# Altium schematic sheet Minimum_system.SchDoc
size 431 x 279 mm; ENG_APP_DATE: --/--/--; DSN_APP_DATE: --/--/--; CHK_APP_DATE: --/--/--
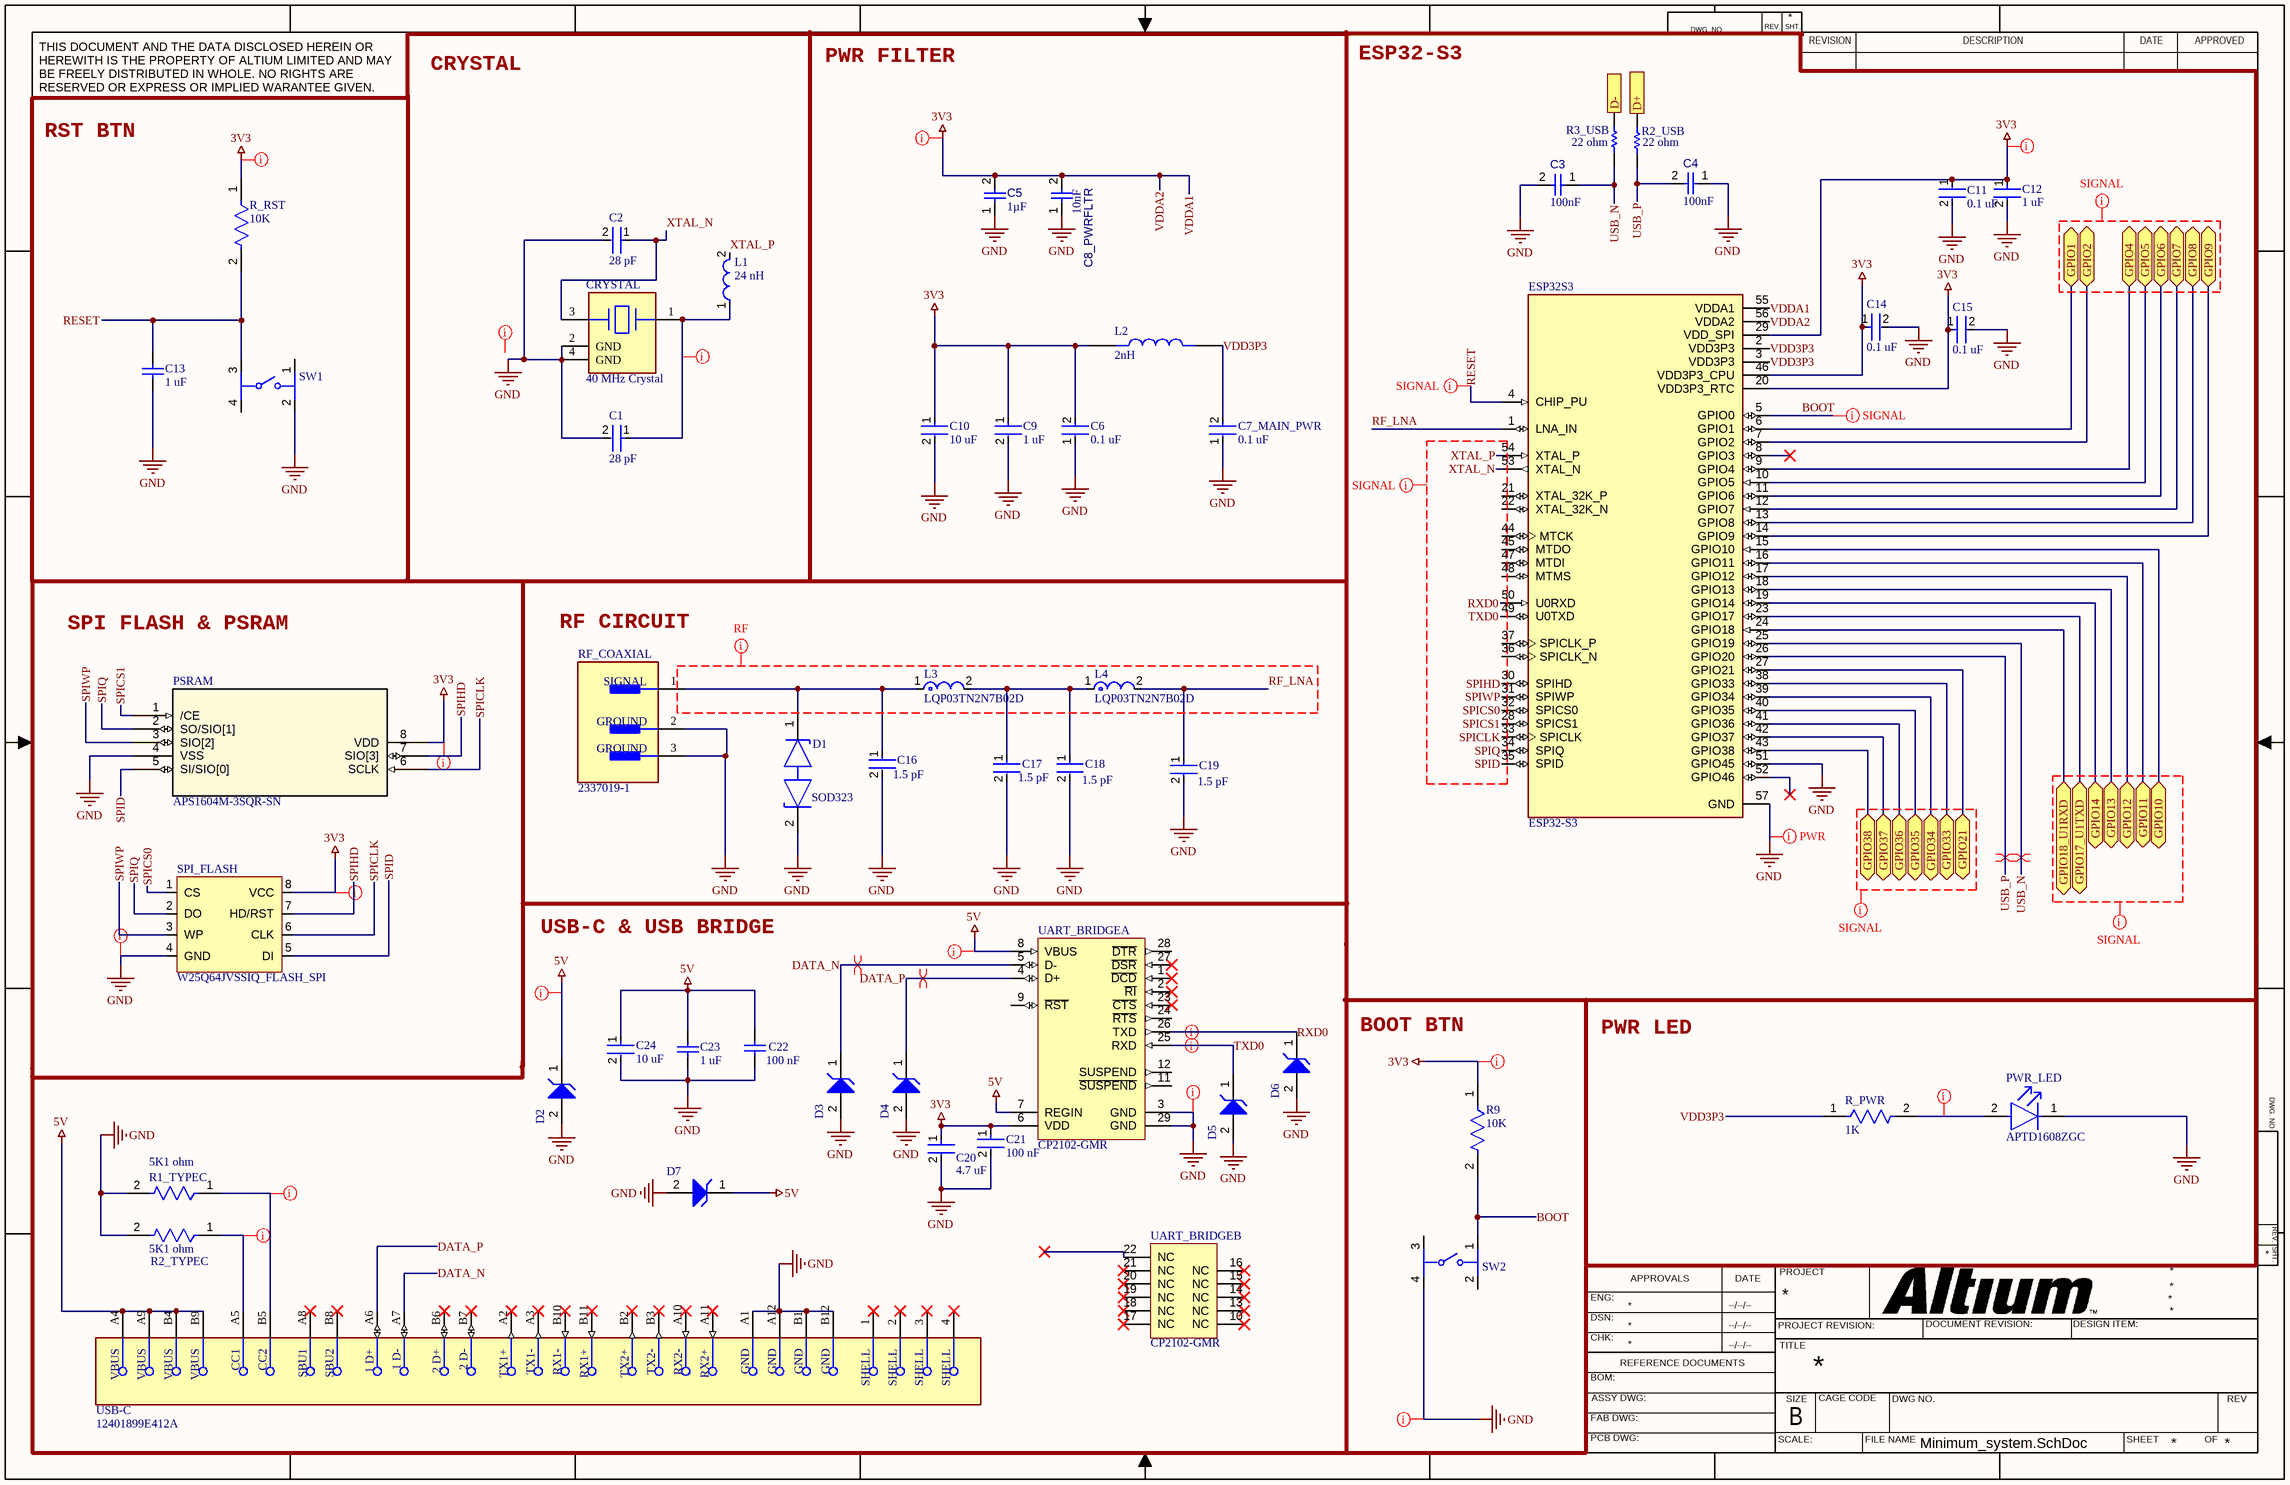
[diagram p0: Minimum_system.SchDoc]

## Parts
C1  28 pF  [FP-GQM219-0_15-MFG]
C2  28 pF  [FP-GQM219-0_15-MFG]
C3  value 100nF  [CAPC0402(1005)60_L]  (hidden comment: Capacitor 100nF +/-20% 50V 0402)
C4  value 100nF  [CAPC0402(1005)60_L]  (hidden comment: Capacitor 100nF +/-20% 50V 0402)
C5  value 1µF  [CAPC1608X90X35ML15T15]  (hidden comment: Capacitor 1uF +/- 10% 16V 0603)
C6  0.1 uF  [FP-C1608-080-0_1-IPC_B]
C7_MAIN_PWR  0.1 uF  [FP-C1608-080-0_1-IPC_B]
C8_PWRFLTR  value 10nF  [CAPC0402(1005)60_L]  (hidden comment: Capacitor 10nF +/-20% 50V 0402)
C9  1 uF  [FP-GRM21B-0_2-e0_2_0_7-MFG]
C10  10 uF  [FP-GRM188-0_15-IPC_C]
C11  0.1 uF  [FP-C1608-080-0_1-IPC_B]
C12  1 uF  [FP-GRM21B-0_2-e0_2_0_7-MFG]
C13  1 uF  [CAPC2013X140X50NL20T25]
C14  0.1 uF  [FP-CC0201-BA-MFG]
C15  0.1 uF  [FP-CC0201-BA-MFG]
C16  1.5 pF  [FP-GRM033-0_03-MFG]
C17  1.5 pF  [FP-GRM033-0_03-MFG]
C18  1.5 pF  [FP-GRM033-0_03-MFG]
C19  1.5 pF  [FP-GRM033-0_03-MFG]
C20  4.7 uF  [FP-GCJ31C-0_3-IPC_C]
C21  100 nF  [FP-GRM155-0_05-MFG]
C22  100 nF  [CAPC0603X33X15NL03T05]
C23  1 uF  [CAPC2013X140X50NL20T25]
C24  10 uF  [FP-GRM188-0_15-IPC_C]
CRYSTAL  40 MHz Crystal  [FP-ABM8AIG-MFG]
D1  SOD323  [FP-SOD323-CA-MFG]
D2  824520581  [WE-TVSP_DO-214AA_Unidirectional]  (value not drawn)
D3  824520581  [WE-TVSP_DO-214AA_Unidirectional]  (value not drawn)
D4  824520581  [WE-TVSP_DO-214AA_Unidirectional]  (value not drawn)
D5  824520581  [WE-TVSP_DO-214AA_Unidirectional]  (value not drawn)
D6  824520581  [WE-TVSP_DO-214AA_Unidirectional]  (value not drawn)
D7  824520581  [WE-TVSP_DO-214AA_Unidirectional]  (value not drawn)
ESP32S3  ESP32-S3  [IC_ESP32-S3]
L1  24 nH  [FP-LQW15AN_00-W0_5-0_1-MFG]
L2  value 2nH  [INDC0603X28N]  (hidden comment: ATFC-0201HQ-2N0B-T)
L3  LQP03TN2N7B02D  [FP-LQP03TG_02-IPC_A]
L4  LQP03TN2N7B02D  [FP-LQP03TG_02-IPC_A]
PSRAM  APS1604M-3SQR-SN  [SOP8L_APS1604M-3SQR-SN_APY]
PWR_LED  APTD1608ZGC  [FP-APTD1608ZGC-MFG]
R1_TYPEC  5K1 ohm  [FP-CRCW1206-e3-IPC_B]
R2_TYPEC  5K1 ohm  [FP-CRCW1206-e3-IPC_B]
R2_USB  22 ohm  [RESC1608X55X25LL10T15]
R3_USB  22 ohm  [RESC1608X55X25LL10T15]
R9  10K  [FP-AC0603-IPC_A]
R_PWR  1K  [FP-RP732B-MFG]
R_RST  10K  [FP-AC0603-IPC_A]
RF_COAXIAL  2337019-1  [FP-2337019-1-MFG]
SPI_FLASH  W25Q64JVSSIQ_FLASH_SPI  [SOIC127P790X216-8N]
SW1  PTS810SJM250SMTRLFS  [FP-PTS810SJM250SMTRLFS-MFG]  (value not drawn)
SW2  PTS810SJM250SMTRLFS  [FP-PTS810SJM250SMTRLFS-MFG]  (value not drawn)
UART_BRIDGE  CP2102-GMR  [SLAB-QFN-28-3125x3125TP_M]  (parts A,B of 2)
USB-C  12401899E412A  [FP-12401899E412A-MFG]

## Ports
D+, D-, GPIO1 (bidir), GPIO2 (bidir), GPIO4 (bidir), GPIO5 (bidir), GPIO6 (bidir), GPIO7 (bidir), GPIO8 (bidir), GPIO9 (bidir), GPIO10 (bidir), GPIO11 (bidir), GPIO12 (bidir), GPIO13 (bidir), GPIO14 (bidir), GPIO17_U1TXD (bidir), GPIO18_U1RXD (bidir), GPIO21 (bidir), GPIO33 (bidir), GPIO34 (bidir), GPIO35 (bidir), GPIO36 (bidir), GPIO37 (bidir), GPIO38 (bidir)

## Nets
5V: C22.2 C23.1 C24.1 D2.1(K) D7.1(K) UART_BRIDGE.7(REGIN) UART_BRIDGE.8(VBUS) USB-C.A4(VBUS) USB-C.A9(VBUS) USB-C.B4(VBUS) USB-C.B9(VBUS)
GND: C1.2 C2.2 C3.2 C4.1 C5.1 C6.1 C7_MAIN_PWR.1 C8_PWRFLTR.1 C9.2 C10.2 C11.2 C12.2 C13.2 C14.2 C15.2 C16.2 C17.2 C18.2 C19.2 C20.2 C21.2 C22.1 C23.2 C24.2 CRYSTAL.2(GND) CRYSTAL.4(GND) D1.2(K2) D2.2(A) D3.2(A) D4.2(A) D5.2(A) D6.2(A) D7.2(A) ESP32S3.51(GPIO45) ESP32S3.57(GND) PSRAM.4(VSS) PWR_LED.1(C) R1_TYPEC.2 R2_TYPEC.2 RF_COAXIAL.2(GROUND) RF_COAXIAL.3(GROUND) SPI_FLASH.4(GND) SW1.2 SW2.4 UART_BRIDGE.3(GND) UART_BRIDGE.29(GND) USB-C.A1(GND) USB-C.A12(GND) USB-C.B1(GND) USB-C.B12(GND)
VDDA1: C5.2 C6.2 C8_PWRFLTR.2 C9.1 C10.1 C11.1 C12.1 C14.1 C15.1 C20.1 C21.1 ESP32S3.20(VDD3P3_RTC) ESP32S3.29(VDD_SPI) ESP32S3.46(VDD3P3_CPU) ESP32S3.55(VDDA1) ESP32S3.56(VDDA2) L2.1 PSRAM.8(VDD) R9.1 R_RST.1 SPI_FLASH.8(VCC) UART_BRIDGE.6(VDD)  [also labelled 3V3, VDDA2]
BOOT: ESP32S3.5(GPIO0) R9.2 SW2.1
D+: R2_USB.1 ; port D+
D-: R3_USB.1 ; port D-
DATA_N: D3.1(K) UART_BRIDGE.5(D-) USB-C.A7(1_D-)
DATA_P: D4.1(K) UART_BRIDGE.4(D+) USB-C.A6(1_D+)
GPIO1: ESP32S3.6(GPIO1) ; port GPIO1
GPIO2: ESP32S3.7(GPIO2) ; port GPIO2
GPIO4: ESP32S3.9(GPIO4) ; port GPIO4
GPIO5: ESP32S3.10(GPIO5) ; port GPIO5
GPIO6: ESP32S3.11(GPIO6) ; port GPIO6
GPIO7: ESP32S3.12(GPIO7) ; port GPIO7
GPIO8: ESP32S3.13(GPIO8) ; port GPIO8
GPIO9: ESP32S3.14(GPIO9) ; port GPIO9
GPIO10: ESP32S3.15(GPIO10) ; port GPIO10
GPIO11: ESP32S3.16(GPIO11) ; port GPIO11
GPIO12: ESP32S3.17(GPIO12) ; port GPIO12
GPIO13: ESP32S3.18(GPIO13) ; port GPIO13
GPIO14: ESP32S3.19(GPIO14) ; port GPIO14
GPIO17_U1TXD: ESP32S3.23(GPIO17) ; port GPIO17_U1TXD
GPIO18_U1RXD: ESP32S3.24(GPIO18) ; port GPIO18_U1RXD
GPIO21: ESP32S3.27(GPIO21) ; port GPIO21
GPIO33: ESP32S3.38(GPIO33) ; port GPIO33
GPIO34: ESP32S3.39(GPIO34) ; port GPIO34
GPIO35: ESP32S3.40(GPIO35) ; port GPIO35
GPIO36: ESP32S3.41(GPIO36) ; port GPIO36
GPIO37: ESP32S3.42(GPIO37) ; port GPIO37
GPIO38: ESP32S3.43(GPIO38) ; port GPIO38
RESET: C13.1 ESP32S3.4(CHIP_PU) R_RST.2 SW1.3
RF_LNA: C19.1 ESP32S3.1(LNA_IN) L4.2
RXD0: D6.1(K) ESP32S3.50(U0RXD) UART_BRIDGE.26(TXD)
SPICLK: ESP32S3.33(SPICLK) PSRAM.6(SCLK) SPI_FLASH.6(CLK)
SPICS0: ESP32S3.32(SPICS0) SPI_FLASH.1(CS)
SPICS1: ESP32S3.28(SPICS1) PSRAM.1(/CE)
SPID: ESP32S3.35(SPID) PSRAM.5(SI/SIO[0]) SPI_FLASH.5(DI)
SPIHD: ESP32S3.30(SPIHD) PSRAM.7(SIO[3]) SPI_FLASH.7(HD/RST)
SPIQ: ESP32S3.34(SPIQ) PSRAM.2(SO/SIO[1]) SPI_FLASH.2(DO)
SPIWP: ESP32S3.31(SPIWP) PSRAM.3(SIO[2]) SPI_FLASH.3(WP)
TXD0: D5.1(K) ESP32S3.49(U0TXD) UART_BRIDGE.25(RXD)
USB_N: C3.1 ESP32S3.25(GPIO19) R3_USB.2
USB_P: C4.2 ESP32S3.26(GPIO20) R2_USB.2
VDD3P3: C7_MAIN_PWR.2 ESP32S3.2(VDD3P3) ESP32S3.3(VDD3P3) L2.2 R_PWR.1
XTAL_N: C2.1 CRYSTAL.3 ESP32S3.53(XTAL_N)
XTAL_P: ESP32S3.54(XTAL_P) L1.2
NetC1_1: C1.1 CRYSTAL.1 L1.1
NetC16_1: C16.1 D1.1(K1) L3.1 RF_COAXIAL.1(SIGNAL)
NetC17_1: C17.1 C18.1 L3.2 L4.1
NetPWR_LED_2: PWR_LED.2(A) R_PWR.2
NetR1_TYPEC_1: R1_TYPEC.1 USB-C.B5(CC2)
NetR2_TYPEC_1: R2_TYPEC.1 USB-C.A5(CC1)

Not connected (* = marked no-connect by the designer): ESP32S3 8(GPIO3)* 21(XTAL_32K_P) 22(XTAL_32K_N) 36(SPICLK_N) 37(SPICLK_P) 44(MTCK) 45(MTDO) 47(MTDI) 48(MTMS) 52(GPIO46)*; SW1 1 4; SW2 2 3; UART_BRIDGE 1(~{DCD})* 2(~{RI})* 9(~{RST}) 10(NC)* 11(~{SUSPEND}) 12(SUSPEND) 13(NC)* 14(NC)* 15(NC)* 16(NC)* 17(NC)* 18(NC)* 19(NC)* 20(NC)* 21(NC)* 22(NC)* 23(~{CTS})* 24(~{RTS}) 27(~{DSR})* 28(~{DTR}); USB-C 1(SHELL)* 2(SHELL)* 3(SHELL)* 4(SHELL)* A2(TX1+)* A3(TX1-)* A8(SBU1)* A10(RX2-)* A11(RX2+)* B2(TX2+)* B3(TX2-)* B6(2_D+)* B7(2_D-)* B8(SBU2)* B10(RX1-)* B11(RX1+)*

## Layout directives
differential pair: DATA_N, DATA_P, USB_N, USB_P
net class SIGNAL: (no net found under the mark), BOOT, RXD0, SPICLK, SPICS0, SPICS1, SPID, SPIHD, SPIQ, SPIWP, TXD0, XTAL_N, XTAL_P
net class POWER: 5V, (no net found under the mark), GND, NetC1_1, NetPWR_LED_2, NetR1_TYPEC_1, NetR2_TYPEC_1, VDDA1
mark named SIGNAL: RESET
net class RF: RF_LNA

## Notes on the sheet
- CRYSTAL
- PWR FILTER
- ESP32-S3
- RST BTN
- SPI FLASH & PSRAM
- RF CIRCUIT
- USB-C & USB BRIDGE
- BOOT BTN
- PWR LED
- Labels drawn without touching a wire or pin: \
- DWG. NO.
- REV.
- SHT.
- THIS DOCUMENT AND THE DATA DISCLOSED HEREIN OR HEREWITH IS THE PROPERTY OF ALTIUM LIMITED AND MAY BE FREELY DISTRIBUTED IN WHOLE. NO RIGHTS ARE RESERVED OR EXPRESS OR IMPLIED WARANTEE GIVEN.
- REVISION
- DESCRIPTION
- DATE
- APPROVED
- ENG:
- APPROVALS
- PROJECT
- DSN:
- CHK:
- REFERENCE DOCUMENTS
- PROJECT REVISION:
- TITLE
- DOCUMENT REVISION:
- DESIGN ITEM:
- BOM:
- FAB DWG:
- PCB DWG:
- ASSY DWG:
- SCALE:
- SIZE
- B
- CAGE CODE
- FILE NAME
- DWG NO.
- SHEET
- OF
- REV

## Library data of the parts
C1 C2 = CMP-06035-024923-1: Ceramic Capacitor 28pF ±2% 250VDC C0G 0805 Paper T/R
C3 C4 = CMP-001-00067-3: Chip Capacitor, 100nF +/-20%, 50V, 0402, Thickness 0.6 mm; Tolerance: 10%; Min Operating Temperature: -55°C; Pins: 2; Case/Package: 0402; Max Operating Temperature: 85°C; Voltage Rating: 50V; Mounting Technology: SMT
C5 = CMP-001-00004-6: Chip Capacitor, 1 uF, +/- 10%, 16 V, 0603 (1608 Metric); Capacitor Type: Ceramic; Mounting Technology: SM; RoHS Compliant: True; Min Operating Temperature: -55°C; Case/Package: 0603; Pins: 2; Voltage Rating: 16V; Max Operating Temperature: 125°C; Tolerance: 10%
C6 C7_MAIN_PWR C11 = CMP-2000-04982-2: Multilayer Ceramic Capacitors 100nF ±10% 50V X7R SMD 0603; REACH SVHC: No SVHC; Voltage: 50V; Min Operating Temperature: -55°C; Package Quantity: 1; Case Code (Metric): 1608; Series: C; Termination: SMD/SMT; Length: 1.6mm; Voltage Rating: 50V; Case Code (Imperial): 0603; Number of Pins: 2; RoHS Compliant: Yes; Thickness: 0.037inch; Resistor Type: Ceramic; Radiation Hardening: No; Weight: 7.1E-05oz; Mount: Surface Mount; Capacitance: 100nF; Voltage Rating (DC): 50V; Construction: Flat; Tolerance: 10%; Lead Free: Lead Free; Case/Package: 0603; Max Operating Temperature: 125°C; Height: 0.8mm; Depth: 0.8mm; Packaging: Tape and Reel; Width: 0.031inch; Dielectric Material: Ceramic; Dielectric: X7R
C8_PWRFLTR = CMP-001-00069-3: Chip Capacitor, 10nF +/-20%, 50V, 0402, Thickness 0.6 mm; Tolerance: 5%; Max Operating Temperature: 85°C; Pins: 2; Case/Package: 0402; Voltage Rating: 50V; Min Operating Temperature: -55°C; Mounting Technology: SMT
C9 C12 = CMP-06035-022504-1: Chip Multilayer Ceramic Capacitors for General Purpose, 0805, 1.0uF, X7S, 22%, 10%, 100V; Capacitance: 1uF; Width: 1.25mm; Dielectric: X7S; Length: 2mm; Thickness: 1.25mm; Voltage Rating (DC): 100V; Tolerance: 10%
C10 C24 = CMP-06035-033844-1: Chip Multilayer Ceramic Capacitors for General Purpose, 0603, 10uF, X5R, 15%, 20%, 10V; Dielectric: X5R; Thickness: 800um; Tolerance: 20%; Length: 1.6mm; Voltage Rating (DC): 10V; Width: 800um; Capacitance: 10uF
C13 C23 = CMP-2007-04663-1: Part Number: 0805YD105MAT2A; Manufacturer: AVX Interconnect / Elco
C14 C15 = CMP-03422-000955-1: CC0201 100 nF X5R 20.00% 10 V; Manufacturer: Yageo; Manufacturer Part Number: CC0201MRX5R6BB104; Tolerance: 0.2; Temperature Coefficient: 15%; Capacitance: 100 nF; Voltage Rating: 10 V; Value: 100 nF; Material: Ceramic; Height: 0.33mm; ComponentLink2Description: Datasheet; Device Class L3: Ceramic Capacitors; Lead Free: Yes; Temperature Range Low: -55°C; Temperature Range High: +85°C; Mouser Description: Cap Ceramic 0.1uF 10V X5R 20% SMD 0201 85°C Paper T/R; Automotive: No; Temperature Characteristic: X5R; RoHS: TRUE; Octopart: https://octopart.com/cc0201mrx5r6bb104-yageo-82228190; Ipc Land Pattern Name: CAPC6030X30; ComponentLink2URL: http://www.yageo.com/documents/recent/UPY-GPHC_X5R_4V-to-50V_25.pdf; Temperature: -55°C to +85°C; Category: Cap; Package: CC0201-BA; Device Class L2: Capacitors; Footprint Url: http://www.yageo.com/exep/pages/download/literatures/UPY-C_GEN_24.pdf; Device Class L1: Passive Components
C16-C19 = CMP-2010-01517-2: Chip Multilayer Ceramic Capacitors for General Purpose, 0201, 1.5pF, C0G, 30ppm/°C, 0.1pF, 50V; Case Code (Imperial): 0201; Width: 0.012inch; Case Code (Metric): 0603; Length: 0.024inch; Termination: SMD/SMT; Mount: Surface Mount; Min Operating Temperature: -55°C; Case/Package: 0201; Package Quantity: 15000; Thickness: 0.013inch; Packaging: Tape and Reel; Capacitance: 1.5pF; Max Operating Temperature: 125°C; Voltage Rating: 50V; Voltage Rating (DC): 50V
C20 = CMP-06035-027821-1: Cap Ceramic 4.7uF 16V X7R 10% Pad SMD 1206 Soft Termination  +125°C Automotive T/R
C21 = CMP-06035-062118-1: Chip Multilayer Ceramic Capacitors for General Purpose, 0402, 0.10uF, X7R, 15%, 20%, 50V; RoHS Compliant: Yes
C22 = CMP-1033-00660-2: Part Number: 02016D104KAT4A; Manufacturer: AVX Interconnect / Elco
CRYSTAL = CMP-27762-015630-1: Crystal 40MHz ±20ppm (Tol) ±100ppm (Stability) 12pF FUND 35Ω Automotive 4-Pin Ultra Mini-CSMD T/R; ESR (Equivalent Series Resistance): 35R; Packaging: Tape and Reel; Height: 0.031inch; Min Operating Temperature: -40°C; Length: 0.126inch; Width: 0.098inch; Frequency: 40MHz; Series: ABM8AIG; Ratings: AEC-Q200; RoHS Compliant: Yes; Frequency Stability: 100ppm; Max Operating Temperature: 125°C; Case/Package: SMD/SMT; Load Capacitance: 12pF; Frequency Tolerance: 20ppm; Mount: Surface Mount
D1 = CMP-14432-000001-1: TVS DIODE 5V 14V SOD323
D2-D7 = CMP-03913-71101600-2: TVS diode [Würth Elektronik] 824520581 TVS diode; Power Line Protection: No; Max Breakdown Voltage: 67.8V; Peak Pulse Power: 600W; Peak Pulse Current: 6.5A; Leakage Current: 1µA; Number of Unidirectional Channels: 1; Clamping Voltage: 93.6V; Polarity: Unidirectional; Reverse Standoff Voltage: 58V; Packaging: Cut Tape; Composition: Zener; Mount: Surface Mount; REACH SVHC: Unknown; RoHS: Compliant; Height: 2.4mm; Length: 4.32mm; Max Operating Temperature: 150°C; Min Operating Temperature: -65°C; Number of Pins: 2; Width: 3.62mm; Min Breakdown Voltage: 67.8V
ESP32S3 = CMP-031-00006-2: IC RF TxRx + MCU Bluetooth, WiFi 802.11b/g/n, Bluetooth v5.0 2.412GHz ~ 2.484GHz 56-VFQFN Exposed Pad; MF: Espressif Systems; Purchase-URL: https://pricing.snapeda.com/search/part/ESP32-S3/?ref=eda; Value: *; SnapEDA_Link: https://www.snapeda.com/parts/ESP32-S3/Espressif+Systems/view-part/?ref=snap; Component Type: Standard; Case/Package: None; Design Item ID: ESP32-S3; Availability: In Stock; Pins: 57; MP: ESP32-S3; Source: ESP32-S3.SchLib; Check_prices: https://www.snapeda.com/parts/ESP32-S3/Espressif+Systems/view-part/?ref=eda; Price: None
L1 = CMP-06042-007532-1: Wire Wound RF Inductor 24nH ±2% 280mA 0.52Ω 0402 (1005); Q Factor: 25; Core Material: Air; Test Frequency: 100MHz; Current: 270mA; Self Resonant Frequency: 3.5GHz; Shielding: Unshielded; DC Resistance (DCR): 520mR; Height: 0.5mm; Lead Free: Lead Free; Max DC Current: 280mA; Width: 0.02inch; Number of Pins: 2; Inductance Tolerance: 2%; Military Standard: Not; REACH SVHC: No SVHC; Case Code (Imperial): 0402; Inductance: 24nH; Case/Package: 0402; Current Rating: 280mA; Min Operating Temperature: -55°C; Case Code (Metric): 1005; Length: 1mm; Mount: Surface Mount; DC Current: 280mA; Weight: 2.8E-05oz; Package Quantity: 10000; Termination: SMD/SMT; Packaging: Tape and Reel; Max Operating Temperature: 125°C; Depth: 0.6mm; Tolerance: 2%
L2 = CMP-006-00023-1: MF: {'manufacturer': u'Abracon LLC'}; MP: ATFC-0201HQ-2N0B-T; Design Item ID: ATFC-0201HQ-2N0B-T; Availability: Unavailable; Component Type: Standard; Case/Package: None; Price: None; Source: ATFC-0201HQ-2N0B-T.SchLib; Pins: 2
L3 L4 = CMP-06042-013213-1: Film type RF Inductor 2.7nH ±0.1nH 500mA 0.2Ω 0201 (0603); Core Material: Non-Magnetic; Tolerance: 3%; Self Resonant Frequency: 6GHz; Current: 350mA; Test Frequency: 500MHz; Q Factor: 14; DC Resistance (DCR): 200mR; Shielding: Unshielded; DC Current: 500mA; Resistor Type: Thin Film; Case/Package: 0201; Max DC Current: 500mA; Length: 0.024inch; Case Code (Imperial): 0201; Min Operating Temperature: -55°C; Width: 0.3mm; Termination: SMD/SMT; Inductance: 2.7nH; REACH SVHC: No SVHC; Max Operating Temperature: 125°C; Height: 0.3mm; Height - Seated (Max): 0.013inch; Military Standard: Not; Packaging: Tape and Reel; Radiation Hardening: No; Lead Free: Lead Free; Package Quantity: 15000; Case Code (Metric): 0603; Current Rating: 500mA; Mount: Surface Mount; Depth: 0.33mm
PSRAM = CMP-014-000000-2: 2 MB PSRAM SPI; Manufacturer_Name: AP Memory; Pin Count: 8; RefDes: RefDes; Type: Type; Manufacturer_Part_Number: APS1604M-3SQR-SN; Copyright: Copyright (C) 2026 Ultra Librarian. All rights reserved.; Source: APS1604M-3SQR-SN.SchLib; Design Item ID: APS1604M-3SQR-SN; Component Type: Standard
PWR_LED = CMP-44529-000047-1: LED GREEN CLEAR CHIP SMD; Forward Current: 20mA; Viewing Angle: 60°; Dominant Wavelength: 525nm; Luminous Intensity: 780mcd; Forward Voltage: 3.3V; Lens Style: Clear; Max Operating Temperature: 85°C; Case/Package: 0603; Illumination Color: Green; Mount: Surface Mount; Case Code (Imperial): 0603; Case Code (Metric): 1608; Min Operating Temperature: -40°C; Length: 1.6mm; Color: Green; Lead Free: Lead Free; Width: 0.8mm; Package Quantity: 2000; Height: 0.95mm; Packaging: Tape and Reel; Test Current: 20mA
R1_TYPEC R2_TYPEC = CMP-1014-00091-2: RES Thick Film, 5.1kΩ, 5%, 0.25W, 200ppm/°C, 1206; Max Power Dissipation: 250mW; Resistance: 5.1kR; Packaging: Tape and Reel; Length: 0.126inch; Case/Package: 1206; Lead Free: Lead Free; Tolerance: 5%; Composition: Thick Film; Min Operating Temperature: -55°C; Height: 0.024inch; Temperature Coefficient: 200ppm/°C; Features: Automotive AEC-Q200; Width: 0.063inch; Number of Terminations: 2; Max Operating Temperature: 155°C; Package Quantity: 20000
R2_USB R3_USB = CMP-2000-04180-1: Manufacturer: Yageo; Part Number: RC0603FR-1022RL
R9 R_RST = CMP-03412-040683-1: RES 10kΩ 5.00% 0.2W 0603
R_PWR = CMP-03211-010976-1: Res Thin Film 1206 1.0KΩ 0.1% 0.25W 15ppm/°C Molded SMD; Manufacturer: TE Connectivity; Manufacturer Part Number: RP73D2B1K0BTDF; Voltage Rating: 200V; Lead Free: Yes; RoHS: TRUE; Category: Res; Tolerance: 0.1%; Octopart: https://octopart.com/rp73d2b1k0btdf-te+connectivity-22741139; packaging: 1000 Reel; Device Class L2: Resistors; Power Rating: 0.25W; Value: 1.0KΩ; Device Class L1: Passive Components; Device Class L3: Chip SMD Resistors; Temperature Range Low: -55°C; Package: RP732B; Series: RP73; Height: 0.65mm; Composition: Thin Film; Temperature Range High: 155°C; Automotive: No; Temperature Coefficient: 15ppm/°C; octopart_url: https://octopart.com/rp73d2b1k0btdf-te+connectivity-22741139; Temperature: -55°C to 155°C; Ipc Land Pattern Name: RESC305155X55; ComponentLink2Description: Datasheet; Resistance: 1.0KΩ; ComponentLink2URL: https://www.te.com/commerce/DocumentDelivery/DDEController?Action=showdoc&DocId=Data+Sheet%7F1773272%7FL%7Fpdf%7FEnglish%7FENG_DS_1773272_L.pdf%7F8-1879255-6
RF_COAXIAL = CMP-03357-000011-1: UMCC MICRO-COAX RECEPTACLE, GEN
SPI_FLASH = CMP-012-000000-2: 8 MB flash SPI; Component Type: Standard; Pin Count: 8; Design Item ID: Component_1; Source: W25Q64JVSSIQ.SchLib
SW1 SW2 = CMP-10040-000001-2: SWITCH TACTILE SPST-NO 0.05A 16V; Throw Configuration: SPST; Operating Force: 160gf; Actuator Type: Standard; Switch Travel: 0.15mm; Switch Function: Off-Mom; Max Current Rating: 50mA; Mechanical Life: 150000Cycles; Illumination Type: Non-Illuminated; Package Quantity: 2900; Depth: 4.6mm; Mount: Surface Mount; Packaging: Tape and Reel; Length: 3.2mm; RoHS Compliant: Yes; Case/Package: SMD/SMT; Voltage Rating (DC): 16V; Min Operating Temperature: -40°C; Termination: J-Bend; Lead Free: Lead Free; Contact Plating: Silver; Orientation: Straight; Max Operating Temperature: 85°C; Current Rating: 50mA; Color: Black
UART_BRIDGE = CMP-2000-04924-1: Single-Chip USB to URAT Bridge, 3.3 V, -40 to 85 degC, 28-Pin QFN, RoHS, Tape and Reel; Manufacturer: Silicon Labs; Interface Circuit Standard 1: RS-232; Transmitter and Receiver FIFO Counter: No; Supply Current: 26mA; Operating Supply Voltage (Min): 3V; Operating Supply Voltage (Typ): 3.3V; Data Rate: 1000kbps; Operating Supply Voltage (Max): 3.6V; Number of Channels: 1; Package URL: http://www.silabs.com/Support%20Documents/TechnicalDocs/C8051T61x.pdf; Operating Temperature (Max): 85C; Datasheet URL: http://www.mouser.com/ds/2/368/CP2102-9-247052.pdf; Operating Temperature Classification: Industrial; Operating Temperature (Min): -40C; Package Description: 28-Pin Quad-Flat No-Leads Package, Body 5 x 5 mm, Pitch 0.5 mm; Manufacturer URL: http://www.silabs.com/; Rad Hardened: No; Package Reference: QFN-28; Pin Count: 28; Packaging: TapeandReel; Mounting: SurfaceMount; Package Type: QFNEP; Datasheet Version: Rev. 1.6, 12/2013
USB-C = CMP-02355-000006-1: USB TYPE C, RECEPTACLE, TOP MOUN